# EAGLE design three_led_breakout (EAGLE 6.5.0)
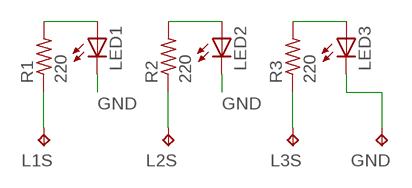
[diagram p0: schematic, sheet 1]

## Parts
GND  TPTP13SQ  [TP13SQ]
L1S  TPTP13R  [TP13R]
L2S  TPTP13R  [TP13R]
L3S  TPTP13R  [TP13R]
LED1  LEDSML0603  [SML0603]
LED2  LEDSML0603  [SML0603]
LED3  LEDSML0603  [SML0603]
R1  220  R-US_R0603  [R0603]
R2  220  R-US_R0603  [R0603]
R3  220  R-US_R0603  [R0603]

## Nets
GND: GND.TP LED1.C LED2.C LED3.C
L1S: L1S.TP R1.1
L2S: L2S.TP R2.1
L3S: L3S.TP R3.1
LEDSUPPLY: LED1.A R1.2
LEDSUPPLY1: LED2.A R2.2
LEDSUPPLY2: LED3.A R3.2

## Library data of the parts
GND L1S L2S L3S = testpad:TP: Test pad
LED1-LED3 = led:LED: LED OSRAM: - CHIPLED LG R971, LG N971, LY N971, LG Q971, LY Q971, LO R971, LY R971 LH N974, LH R974 LS Q976, LO Q976, LY Q976 LO Q996 - Hyper CHIPLED LW Q18S LB Q993, LB Q99A, LB R99A - SideLED LS A670, LO A670, LY A670, LG A670, LP A670 LB A673, LV A673, LT A673, LW A673 LH A674 LY A675 LS A676, LA A676, LO A676, LY A676, LW A676 LS A679, LY A679, LG A679 - Hyper Micro SIDELED® LS Y876, LA Y876, LO Y876, LY Y876 LT Y87S - SmartLED LW L88C, LW L88S LB L89C, LB L89S, LG L890 LS L89K, LO L89K, LY L89K LS L896, LA L896, LO L896, LY L896 - TOPLED LS T670, LO T670, LY T670, LG T670, LP T670 LSG T670, LSP T670, LSY T670, LOP T670, LYG T670 LG T671, LOG T671, LSG T671 LB T673, LV T673, LT T673, LW T673 LH T674 LS T676, LA T676, LO T676, LY T676, LB T676, LH T676, LSB T676, LW T676 LB T67C, LV T67C, LT T67C, LS T67K, LO T67K, LY T67K, LW E67C LS E67B, LA E67B, LO E67B, LY E67B, LB E67C, LV E67C, LT E67C LW T67C LS T679, LY T679, LG T679 LS T770, LO T770, LY T770, LG T770, LP T770 LB T773, LV T773, LT T773, LW T773 LH T774 LS E675, LA E675, LY E675, LS T675 LS T776, LA T776, LO T776, LY T776, LB T776 LHGB T686 LT T68C, LB T68C - Hyper Mini TOPLED® LB M676 - Mini TOPLED Santana® LG M470 LS M47K, LO M47K, LY M47K Source: http://www.osram.convergy.de LUXEON: - LUMILED® LXK2-PW12-R00, LXK2-PW12-S00, LXK2-PW14-U00, LXK2-PW14-V00 LXK2-PM12-R00, LXK2-PM12-S00, LXK2-PM14-U00 LXK2-PE12-Q00, LXK2-PE12-R00, LXK2-PE12-S00, LXK2-PE14-T00, LXK2-PE14-U00 LXK2-PB12-K00, LXK2-PB12-L00, LXK2-PB12-M00, LXK2-PB14-N00, LXK2-PB14-P00, LXK2-PB14-Q00 LXK2-PR12-L00, LXK2-PR12-M00, LXK2-PR14-Q00, LXK2-PR14-R00 LXK2-PD12-Q00, LXK2-PD12-R00, LXK2-PD12-S00 LXK2-PH12-R00, LXK2-PH12-S00 LXK2-PL12-P00, LXK2-PL12-Q00, LXK2-PL12-R00 Source: www.luxeon.com KINGBRIGHT: KA-3528ASYC Source: www.kingbright.com
R1-R3 = rcl:R-US_: RESISTOR, American symbol

## Board
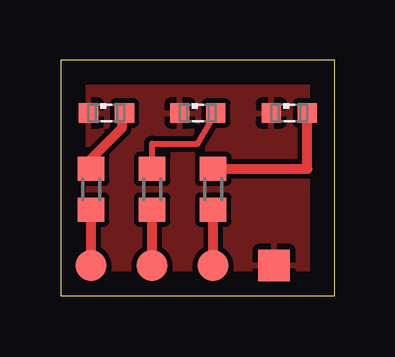
[diagram p1: board, top side]

Size 11.41 x 9.83 mm. Coordinates in mm from the lower left corner, seen from the top.
Outline: 0,0 11.41,0 11.41,9.83 0,9.83 0,0
Copper layers 1: Top 0.035mm
Design rules "1l": minimum track width 6mil, minimum drill 24mil, track to track 8mil, track to pad 8mil, pad to pad 8mil, via to via 8mil, smd to smd 8mil, copper to edge 40mil, drill to drill 8mil, minimum pad ring 10mil, minimum via ring 8mil, stop-mask expansion 4mil, vias tented up to drill 0mil, thermal gap 10mil

### Footprints (pad centres in the part's own frame; a part is rotated, then mirrored left to right if it is on the bottom)
TP13SQ = smd 1.3 x 1.3: TP 0,0
TP13R = smd 1.3 x 1.3: TP 0,0
SML0603 = smd 0.8 x 0.8: A 0.75,0; C -0.75,0
R0603 = smd 1 x 1.1: 1 -0.85,0; 2 0.85,0

### Placement (x,y rotation side)
GND  8.89,1.27 0 top
L1S  1.27,1.27 0 top
L2S  3.81,1.27 0 top
L3S  6.35,1.27 0 top
LED1  1.91,7.62 0 top
LED2  5.71,7.62 0 top
LED3  9.53,7.62 0 top
R1  1.27,4.45 90 top
R2  3.81,4.45 90 top
R3  6.35,4.45 90 top

### Tracks (layer width: path | path; a pad name or v marks a point on that pad's centre or on a via)
GND
  pour Top (isolate 0.203): 0,10.16 0,0 11.43,0 11.43,10.16
L1S
  Top 0.406: L1S.TP R1.1
L2S
  Top 0.406: L2S.TP R2.1
L3S
  Top 0.406: L3S.TP R3.1
LEDSUPPLY
  Top 0.406: R1.2 1.27,5.71 2.54,6.99 2.54,7.62 LED1.A
LEDSUPPLY1
  Top 0.254: R2.2 3.81,6.35 5.71,6.35 LED2.A
LEDSUPPLY2
  Top 0.406: R3.2 10.28,5.29 LED3.A